# Altium schematic sheet main.SchDoc
size A3; SheetNumber: 1; SheetTotal: 1
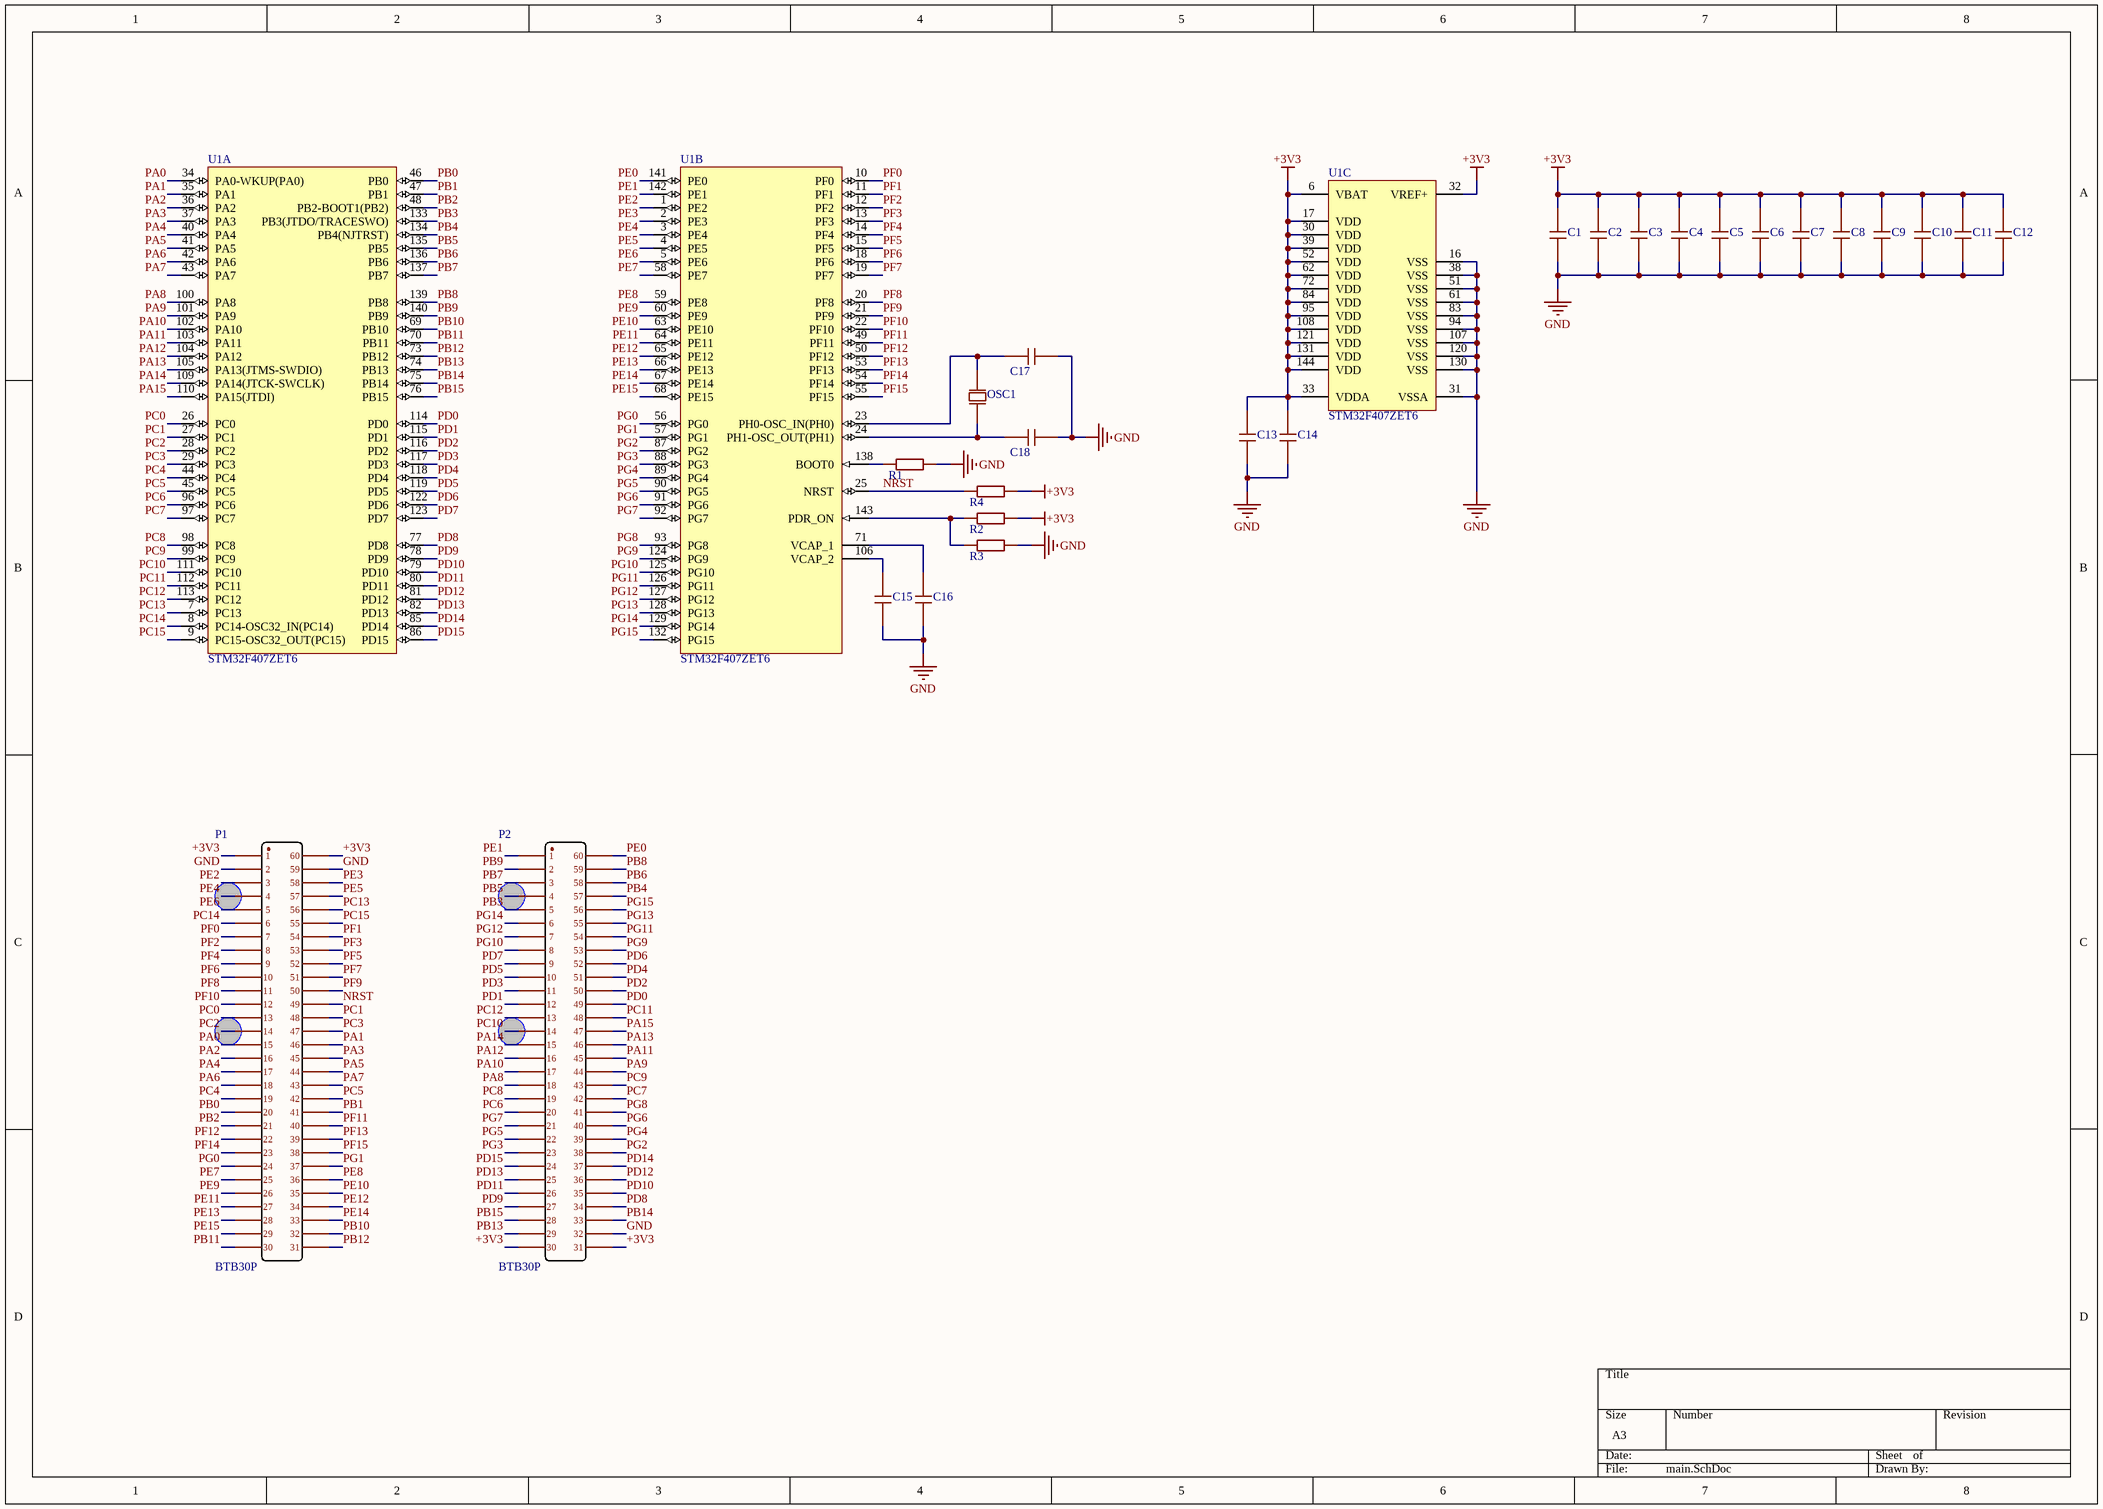
[diagram p0: main.SchDoc]

## Parts
C1  100nF  [0603C]  (value not drawn)
C2  100nF  [0603C]  (value not drawn)
C3  100nF  [0603C]  (value not drawn)
C4  100nF  [0603C]  (value not drawn)
C5  100nF  [0603C]  (value not drawn)
C6  100nF  [0603C]  (value not drawn)
C7  100nF  [0603C]  (value not drawn)
C8  100nF  [0603C]  (value not drawn)
C9  100nF  [0603C]  (value not drawn)
C10  100nF  [0603C]  (value not drawn)
C11  100nF  [0603C]  (value not drawn)
C12  100nF  [0603C]  (value not drawn)
C13  10uF  [0603C]  (value not drawn)
C14  100nF  [0603C]  (value not drawn)
C15  2.2uF  [0603C]  (value not drawn)
C16  2.2uF  [0603C]  (value not drawn)
C17  20pF  [0603C]  (value not drawn)
C18  20pF  [0603C]  (value not drawn)
OSC1  晶振  [OSC_Passive_4P_3225]  (value not drawn)
P1  BTB30P  [BTB_F_30*2*0.8mm]
P2  BTB30P  [BTB_F_30*2*0.8mm]
R1  10K  [0603R]  (value not drawn)
R2  10K  [0603R]  (value not drawn)
R3  NC  [0603R]  (value not drawn)
R4  10K  [0603R]  (value not drawn)
U1  STM32F407ZET6  [STM-LQFP144]  (parts A,B,C of 3)

## Nets
+3V3: C1.2 C2.2 C3.2 C4.2 C5.2 C6.2 C7.2 C8.2 C9.2 C10.2 C11.2 C12.2 C13.2 C14.2 P1.1 P1.60 P2.30 P2.31 R2.2 R4.2 U1.6(VBAT) U1.17(VDD) U1.30(VDD) U1.32(VREF+) U1.33(VDDA) U1.39(VDD) U1.52(VDD) U1.62(VDD) U1.72(VDD) U1.84(VDD) U1.95(VDD) U1.108(VDD) U1.121(VDD) U1.131(VDD) U1.144(VDD)
GND: C1.1 C2.1 C3.1 C4.1 C5.1 C6.1 C7.1 C8.1 C9.1 C10.1 C11.1 C12.1 C13.1 C14.1 C15.2 C16.2 C17.1 C18.1 P1.2 P1.59 P2.32 R1.2 R3.2 U1.16(VSS) U1.31(VSSA) U1.38(VSS) U1.51(VSS) U1.61(VSS) U1.83(VSS) U1.94(VSS) U1.107(VSS) U1.120(VSS) U1.130(VSS)
NRST: P1.49 R4.1 U1.25(NRST)
PA0: P1.15 U1.34(PA0-WKUP(PA0))
PA1: P1.46 U1.35(PA1)
PA2: P1.16 U1.36(PA2)
PA3: P1.45 U1.37(PA3)
PA4: P1.17 U1.40(PA4)
PA5: P1.44 U1.41(PA5)
PA6: P1.18 U1.42(PA6)
PA7: P1.43 U1.43(PA7)
PA8: P2.18 U1.100(PA8)
PA9: P2.44 U1.101(PA9)
PA10: P2.17 U1.102(PA10)
PA11: P2.45 U1.103(PA11)
PA12: P2.16 U1.104(PA12)
PA13: P2.46 U1.105(PA13(JTMS-SWDIO))
PA14: P2.15 U1.109(PA14(JTCK-SWCLK))
PA15: P2.47 U1.110(PA15(JTDI))
PB0: P1.20 U1.46(PB0)
PB1: P1.41 U1.47(PB1)
PB2: P1.21 U1.48(PB2-BOOT1(PB2))
PB3: P2.5 U1.133(PB3(JTDO/TRACESWO))
PB4: P2.57 U1.134(PB4(NJTRST))
PB5: P2.4 U1.135(PB5)
PB6: P2.58 U1.136(PB6)
PB7: P2.3 U1.137(PB7)
PB8: P2.59 U1.139(PB8)
PB9: P2.2 U1.140(PB9)
PB10: P1.32 U1.69(PB10)
PB11: P1.30 U1.70(PB11)
PB12: P1.31 U1.73(PB12)
PB13: P2.29 U1.74(PB13)
PB14: P2.33 U1.75(PB14)
PB15: P2.28 U1.76(PB15)
PC0: P1.13 U1.26(PC0)
PC1: P1.48 U1.27(PC1)
PC2: P1.14 U1.28(PC2)
PC3: P1.47 U1.29(PC3)
PC4: P1.19 U1.44(PC4)
PC5: P1.42 U1.45(PC5)
PC6: P2.20 U1.96(PC6)
PC7: P2.42 U1.97(PC7)
PC8: P2.19 U1.98(PC8)
PC9: P2.43 U1.99(PC9)
PC10: P2.14 U1.111(PC10)
PC11: P2.48 U1.112(PC11)
PC12: P2.13 U1.113(PC12)
PC13: P1.56 U1.7(PC13)
PC14: P1.6 U1.8(PC14-OSC32_IN(PC14))
PC15: P1.55 U1.9(PC15-OSC32_OUT(PC15))
PD0: P2.49 U1.114(PD0)
PD1: P2.12 U1.115(PD1)
PD2: P2.50 U1.116(PD2)
PD3: P2.11 U1.117(PD3)
PD4: P2.51 U1.118(PD4)
PD5: P2.10 U1.119(PD5)
PD6: P2.52 U1.122(PD6)
PD7: P2.9 U1.123(PD7)
PD8: P2.34 U1.77(PD8)
PD9: P2.27 U1.78(PD9)
PD10: P2.35 U1.79(PD10)
PD11: P2.26 U1.80(PD11)
PD12: P2.36 U1.81(PD12)
PD13: P2.25 U1.82(PD13)
PD14: P2.37 U1.85(PD14)
PD15: P2.24 U1.86(PD15)
PE0: P2.60 U1.141(PE0)
PE1: P2.1 U1.142(PE1)
PE2: P1.3 U1.1(PE2)
PE3: P1.58 U1.2(PE3)
PE4: P1.4 U1.3(PE4)
PE5: P1.57 U1.4(PE5)
PE6: P1.5 U1.5(PE6)
PE7: P1.25 U1.58(PE7)
PE8: P1.36 U1.59(PE8)
PE9: P1.26 U1.60(PE9)
PE10: P1.35 U1.63(PE10)
PE11: P1.27 U1.64(PE11)
PE12: P1.34 U1.65(PE12)
PE13: P1.28 U1.66(PE13)
PE14: P1.33 U1.67(PE14)
PE15: P1.29 U1.68(PE15)
PF0: P1.7 U1.10(PF0)
PF1: P1.54 U1.11(PF1)
PF2: P1.8 U1.12(PF2)
PF3: P1.53 U1.13(PF3)
PF4: P1.9 U1.14(PF4)
PF5: P1.52 U1.15(PF5)
PF6: P1.10 U1.18(PF6)
PF7: P1.51 U1.19(PF7)
PF8: P1.11 U1.20(PF8)
PF9: P1.50 U1.21(PF9)
PF10: P1.12 U1.22(PF10)
PF11: P1.40 U1.49(PF11)
PF12: P1.22 U1.50(PF12)
PF13: P1.39 U1.53(PF13)
PF14: P1.23 U1.54(PF14)
PF15: P1.38 U1.55(PF15)
PG0: P1.24 U1.56(PG0)
PG1: P1.37 U1.57(PG1)
PG2: P2.38 U1.87(PG2)
PG3: P2.23 U1.88(PG3)
PG4: P2.39 U1.89(PG4)
PG5: P2.22 U1.90(PG5)
PG6: P2.40 U1.91(PG6)
PG7: P2.21 U1.92(PG7)
PG8: P2.41 U1.93(PG8)
PG9: P2.53 U1.124(PG9)
PG10: P2.8 U1.125(PG10)
PG11: P2.54 U1.126(PG11)
PG12: P2.7 U1.127(PG12)
PG13: P2.55 U1.128(PG13)
PG14: P2.6 U1.129(PG14)
PG15: P2.56 U1.132(PG15)
NetC15_1: C15.1 U1.106(VCAP_2)
NetC16_1: C16.1 U1.71(VCAP_1)
NetC17_2: C17.2 OSC1.2 U1.23(PH0-OSC_IN(PH0))
NetC18_2: C18.2 OSC1.1 U1.24(PH1-OSC_OUT(PH1))
NetR1_1: R1.1 U1.138(BOOT0)
NetR2_1: R2.1 R3.1 U1.143(PDR_ON)

## Library data of the parts
C1-C18 = 电容_贴片
OSC1 = 晶振_无源
P1 P2 = 接插件2*30
R1-R4 = 电阻_贴片
U1 = STM32F407ZET6: Manufacturer: STMicroelectronics; Core: ARM Cortex-M4; D/A Converter: 2x12-bit; FLASH Size (Prog) (kB): 512; I/Os (High Current): 114; Internal RAM Size (kB): 192; Operating Frequency(F) (Processor speed) (MHz): 168; Packing: Tray; Supply Voltage(Vcc) max (V): 3.6; Supply Voltage(Vcc) min (V): 1.8; DatasheetVersion: Rev. 4; PackageVersion: Rev. 4, 06/2013; PackageReference: LQFP144; PackageDescription: 144-Pin Low Profile Quad Flat Package, 20 x 20 mm Body, 0.5 mm Pitch; Supplier 1: Digi-Key; Supplier Part Number 1: 497-11903-ND; Supplier 2: Farnell; Supplier Part Number 2: 2215229; Supplier 3: Newark; Supplier Part Number 3: 46W2203; Supplier 4: Newark; Supplier Part Number 4: 87T3795; Supplier 5: Mouser; Supplier Part Number 5: 511-STM32F407ZET6; Mounting Technology: Surface Mount; PartNumber: STM32F407ZET6; ComponentLink1Description: Manufacturer URL; ComponentLink1URL: http://www.st.com/web/en/home.html; ComponentLink2Description: Datasheet; ComponentLink2URL: http://www.st.com/st-web-ui/static/active/en/resource/technical/document/datasheet/DM00037051.pdf; ComponentLink3Description: Package Specification; ComponentLink3URL: http://www.st.com/st-web-ui/static/active/en/resource/technical/document/datasheet/DM00037051.pdf